# Altium project Copy of PUL_V5_RA.PrjPcb
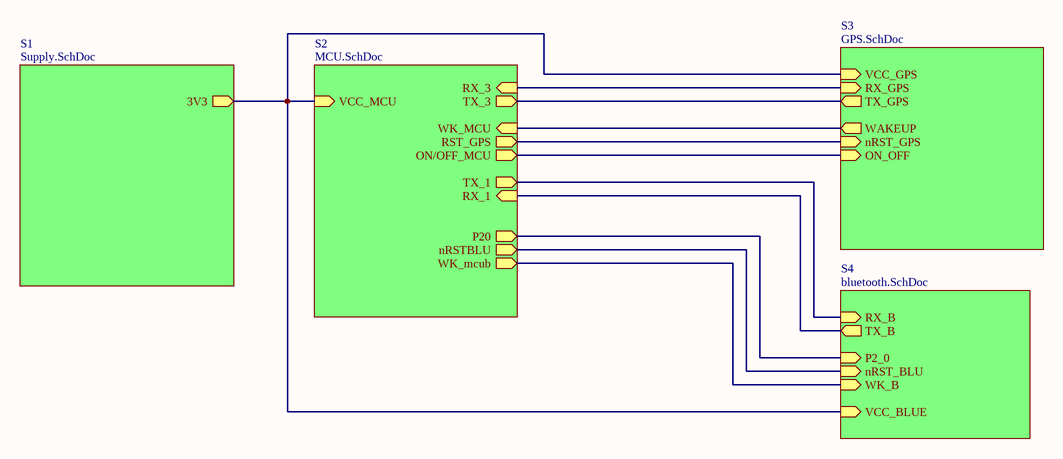
[diagram p0: PUL_V5_RA.SchDoc]
5 sheets, 56 parts. Net scope: hierarchical (ports join the sheet entries above them; power ports are global).
Board file: PUL_V5_RA.PcbDoc
Sheets:
  PUL_V5_RA.SchDoc
    S1 = Supply.SchDoc
    S2 = MCU.SchDoc
    S3 = GPS.SchDoc
    S4 = bluetooth.SchDoc

## Sheet PUL_V5_RA.SchDoc
size Letter

### Sub-sheets
S1 = Supply.SchDoc: 3V3 (out)
S2 = MCU.SchDoc: VCC_MCU (in), RX_3 (in), TX_3 (out), WK_MCU (in), RST_GPS (out), ON/OFF_MCU (out), RX_1 (in), TX_1 (out), P20 (out), nRSTBLU (out), WK_mcub (out)
S3 = GPS.SchDoc: VCC_GPS (in), ON_OFF (in), nRST_GPS (in), WAKEUP (out), RX_GPS (in), TX_GPS (out)
S4 = bluetooth.SchDoc: VCC_BLUE (in), RX_B (in), TX_B (out), P2_0 (in), nRST_BLU (in), WK_B (in)

### Nets
3v3: sheet S1/3V3, sheet S2/VCC_MCU, sheet S3/VCC_GPS, sheet S4/VCC_BLUE
RX: sheet S2/TX_1, sheet S4/RX_B
TX: sheet S2/RX_1, sheet S4/TX_B
NetC30_1: sheet S2/RST_GPS, sheet S3/nRST_GPS
NetC50_1: sheet S2/nRSTBLU, sheet S4/nRST_BLU
NetR26_2: sheet S2/RX_3, sheet S3/RX_GPS
NetR27_2: sheet S2/TX_3, sheet S3/TX_GPS
NetU20_4: sheet S2/WK_mcub, sheet S4/WK_B
NetU20_5: sheet S2/P20, sheet S4/P2_0
NetU20_6: sheet S2/ON/OFF_MCU, sheet S3/ON_OFF
NetU20_7: sheet S2/WK_MCU, sheet S3/WAKEUP

### Notes on the sheet
- Proyecto:
- CENTRO DE INGENIERIA Y DESARROLLO INDUSTRIAL
- Titulo:
- Fecha:
- Hoja:
- Elaborado por:
- de
- Hora:
- Revisión:
- Revisado por:
- CIDESI_template_letter

## Sheet Supply.SchDoc
size Letter
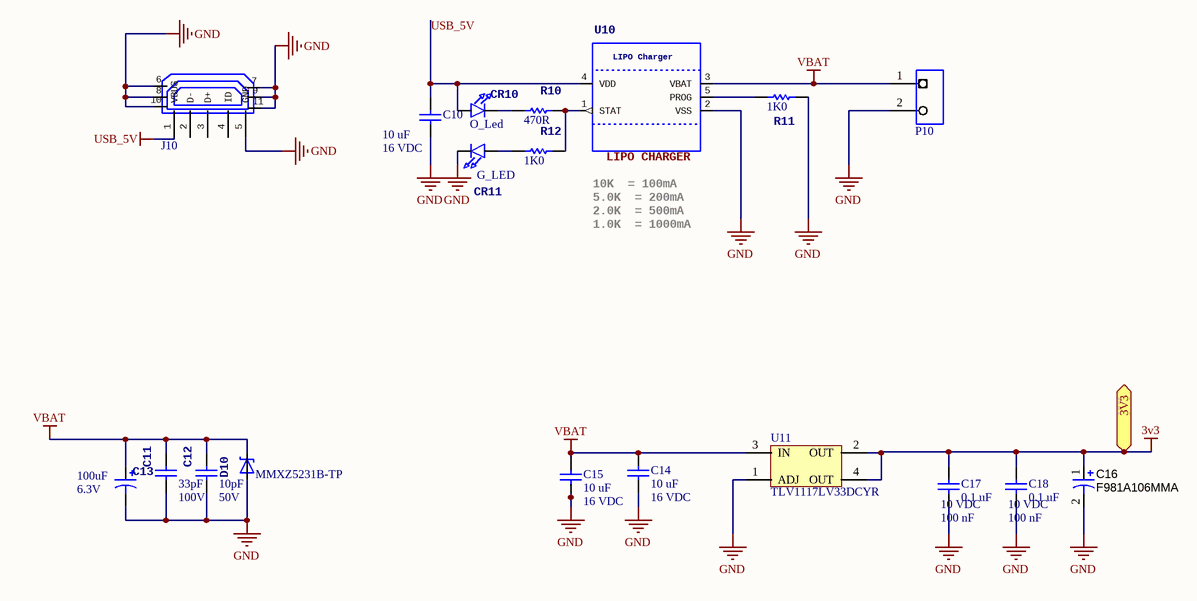
[diagram p1: Supply.SchDoc]

### Parts
C10  Capacitance: 10 uF  Voltage Rating DC: 16 VDC  [C0603]  (hidden comment: EMK107BBJ106MA-T)
C11  Capacitance: 33pF  Voltage Rating: 100V  [0805-C]  (hidden comment: 08051A330JAT2A)
C12  Capacitance: 10pF  Voltage Rating: 50V  [0805-C]  (hidden comment: 04025A100JAT2A)
C13  Capacitance: 100uF  Voltage Rating: 6.3V  [C1210]  (hidden comment: C3225X6S0J107M250AC)
C14  Capacitance: 10 uF  Voltage Rating DC: 16 VDC  [C0603]  (hidden comment: EMK107BBJ106MA-T)
C15  Capacitance: 10 uF  Voltage Rating DC: 16 VDC  [C0603]  (hidden comment: EMK107BBJ106MA-T)
C16  F981A106MMA  [C0603_P]
C17  Capacitance: 0.1 uF  Voltage Rating DC: 10 VDC  Capacitance - nF: 100 nF  [C0402]  (hidden comment: 100 nF, 10 V)
C18  Capacitance: 0.1 uF  Voltage Rating DC: 10 VDC  Capacitance - nF: 100 nF  [C0402]  (hidden comment: 100 nF, 10 V)
CR10  Product: O_Led  [0402-LED_RED]  (hidden comment: Led_Orange_0402)
CR11  Product: G_LED  [0402-LED_GRE]  (hidden comment: SML-P11MTT86R)
D10  Manufacturer Part Number: MMXZ5231B-TP  [SOD-123]  (hidden comment: MMSZ5231BT1G)
J10  1981568-1  [TYCO_19815681N]  (value not drawn)
P10  header  [HDR1X2]  (value not drawn)
R10  Resistance: 470R  [0805-R]  (hidden comment: CRCW0805470RJNEA)
R11  Resistance: 1K0  [0805-R]  (hidden comment: CRCW08051K00JNEB)
R12  Resistance: 1K0  [0805-R]  (hidden comment: CRCW08051K00JNEB)
U10  MCP73831T-2ACI/OT  [SOT23-5]  (value not drawn)
U11  TLV1117LV33DCYR  [SOT230P700X180-4AN]

### Ports
3V3 (out)

### Nets
3v3: C16.1(+) C17.1 C18.1 U11.2(OUT) U11.4(OUT) ; port 3V3
GND: C10.2 C11.2 C12.2 C13.2(-) C14.2 C15.2 C16.2(-) C17.2 C18.2 CR11.K D10.A J10.5(GND) J10.6 J10.7 J10.8 J10.9 J10.10 J10.11 P10.2 R11.2 U10.2(VSS) U11.1(ADJ)
USB_5V: C10.1 CR10.A J10.1(VBUS) U10.4(VDD)
VBAT: C11.1 C12.1 C13.1(+) C14.1 C15.1 D10.C P10.1 U10.3(VBAT) U11.3(IN)
NetCR10_K: CR10.K R10.1
NetCR11_A: CR11.A R12.1
NetR10_2: R10.2 R12.2 U10.1(STAT)
NetR11_1: R11.1 U10.5(PROG)

Not connected (* = marked no-connect by the designer): J10 2(D-) 3(D+) 4(ID)

### Notes on the sheet
- LIPO CHARGER
- 10K  = 100mA
- 5.0K  = 200mA
- 2.0K  = 500mA
- 1.0K  = 1000mA
- Proyecto:
- CENTRO DE INGENIERIA Y DESARROLLO INDUSTRIAL
- Titulo:
- Fecha:
- Hoja:
- Elaborado por:
- de
- Hora:
- Revisión:
- Revisado por:
- CIDESI_template_letter

### Library data of the parts
C10 C14 C15 = 10 uF, 16 V: Cap_Cer; Manufacturer: Taiyo Yuden; Tolerance: 20 %; Type: General Purpose; Class: Class 2; Dielectric: X5R; Supplier 1: Mouser; Manufacturer Part Number: EMK107BBJ106MA-T; RoHS: RoHS Compliant; Category: Multilayer Ceramic Capacitors MLCC - SMD/SMT; Stock 1: 78303; Pricing 1: 1=0.530, 10=0.278, 100=0.163, 500=0.126, 1000=0.100, 4000=0.100 (USD); Diameter: -; Height: 0.8 mm; Length: 1.6 mm; Package / Case: 0603 (1608 metric); Packaging: Reel; Product: General Type MLCCs; Series: M; Termination Style: SMD/SMT; Width: 0.8 mm; Brand: Taiyo Yuden; Case Code - in: 0603; Case Code - mm: 1608; Maximum Operating Temperature: + 85 C; Minimum Operating Temperature: - 55 C; Standard Pack Qty: 4000; Termination: -; RoHS - Mouser: Y; Minimum Order Quantity: 1; Reeling: True; ComponentLink1URL: http://www.mouser.com/ds/2/396/mlcc11_hq_e-541564.pdf; ComponentLink1Description: http://www.mouser.com/ds/2/396/mlcc11_hq_e-541564.pdf; Supplier Part Number 1: 963-EMK107BBJ106MA-T
C11 = 33pF, 100V: Cap_Cer; Manufacturer: AVX; Ceramic Capacitor Case: 0805 [2012 Metric]; Capacitance Tolerance: 5%; Dielectric Characteristic: C0G / NP0; Supplier 1: Newark; Manufacturer Part Number: 08051A330JAT2A; RoHS: YES; Stock 1: 2874; Pricing 1: 1=0.012, 25=0.012, 50=0.012, 100=0.012, 250=0.012, 500=0.012, 1000=0.012, 2500=0.012 (USD); Product Range: -; Packaging: Cut Tape; ComponentLink1URL: http://www.avx.com/docs/Catalogs/cpack.pdf; ComponentLink1Description: http://www.avx.com/docs/Catalogs/cpack.pdf; ComponentLink2URL: http://www.farnell.com/cad/1614359.zip; ComponentLink2Description: http://www.farnell.com/cad/1614359.zip; ComponentLink3URL: http://www.farnell.com/datasheets/2068140.pdf; ComponentLink3Description: http://www.farnell.com/datasheets/2068140.pdf; Supplier Part Number 1: 96K4771
C12 = 10pF, 50V: Cap_Cer; Manufacturer: AVX; Ceramic Capacitor Case: 0402 [1005 Metric]; Capacitance Tolerance: 5%; Dielectric Characteristic: C0G / NP0; Supplier 1: Newark; Manufacturer Part Number: 04025A100JAT2A; RoHS: YES; Stock 1: 235697; Pricing 1: 1=0.003, 25=0.003, 100=0.003, 250=0.003, 500=0.003, 1000=0.003, 2500=0.003 (USD); Product Range: -; Packaging: Cut Tape; ComponentLink1URL: http://www.farnell.com/datasheets/2068140.pdf; ComponentLink1Description: http://www.farnell.com/datasheets/2068140.pdf; Supplier Part Number 1: 96M1128
C13 = 100uF, 6.3V: Cap_Pol; Manufacturer: TDK; Ceramic Capacitor Case: 1210 [3225 Metric]; Capacitance Tolerance: 20%; Dielectric Characteristic: X6; Product Range: C Series; Supplier 1: Newark; Manufacturer Part Number: C3225X6S0J107M250AC; RoHS: YES; Stock 1: 1165; Pricing 1: 1=2.09, 10=1.72, 25=1.48, 50=1.24, 100=1.01, 250=0.95, 500=0.897 (USD); Packaging: Cut Tape; ComponentLink1URL: http://bcove.me/dwwzmldz; ComponentLink1Description: http://bcove.me/dwwzmldz; ComponentLink2URL: http://www.farnell.com/datasheets/2291921.pdf; ComponentLink2Description: http://www.farnell.com/datasheets/2291921.pdf; Supplier Part Number 1: 78Y7998
C16 = 10UF, 10V, C_TAN: CAP_TAN; Manufacturer 1: NICHICON; Value: 10 uF; Product Range: NICHICON - F98 Series; Capacitance: 10; Capacitance Tolerance: ± 20%; Capacitor Case Style: 0603 ^1608 Metric]; ESR: 7.5; Description 1: NICHICON - F981A106MMA - CAPACITOR TANT, 10UF, 10V 20%; Supplier 1: Farnell; Stock 1: 9201; Pricing 1: 1=0.282, 10=0.236, 100=0.169, 250=0.148, 500=0.131, 1000=0.117 (GBP); Voltage Rating: 10; Operating Temperature Max: 125; Series: F98; ComponentLink1URL: http://www.nichicon.co.jp/english/products/pdfs/e-f98.pdf; ComponentLink1Description: http://www.nichicon.co.jp/english/products/pdfs/e-f98.pdf; Supplier Part Number 1: 1853431; Manufacturer Part Number 1: F981A106MMA; RoHS 1: YES; Manufacturer Part Number: F981A106MMA
C17 C18 = 100 nF, 10 V: Cap_Cer; Manufacturer: Murata Electronics; Manufacturer Part Number: GRM155R71A104KA01D; Tolerance: 10 %; Type: General Purpose MLCC; Capacitance - pF: 100000 pF; Dielectric: X7R; Qualification: Commercial; Supplier 1: Mouser; RoHS: RoHS Compliant; Stock 1: 259611; Pricing 1: 1=0.100, 10=0.006, 100=0.004, 500=0.003, 10000=0.003 (USD); Packaging: Reel; ComponentLink1URL: http://www.mouser.com/ds/2/281/c02e-2905.pdf; ComponentLink1Description: http://www.mouser.com/ds/2/281/c02e-2905.pdf; Supplier Part Number 1: 81-GRM155R71A104KA1D; Category: Multilayer Ceramic Capacitors MLCC - SMD/SMT; Height: 0.5 mm; Length: 1 mm; Package / Case: 0402 (1005 metric); Product: General Type MLCCs; Series: GRM; Termination Style: SMD/SMT; Width: 0.5 mm; Brand: Murata Electronics; Case Code - in: 0402; Case Code - mm: 1005; Maximum Operating Temperature: + 125 C; Minimum Operating Temperature: - 55 C; Standard Pack Qty: 10000; RoHS - Mouser: Y; Minimum Order Quantity: 1; Reeling: True
CR10 = Led_Orange_0402: Led_Orange; Manufacturer: ROHM Semiconductor; Manufacturer Part Number: SML-P12DTT86R; Illumination Color: Orange; Luminous Intensity: 100 mcd; If - Forward Current: 20 mA; Lens Transparency: Water Clear; Vf - Forward Voltage: 2.1 V; Wavelength/Color Temperature: 605 nm; Supplier 1: Mouser; RoHS: RoHS Compliant; Category: Standard LEDs - SMD; Stock 1: 22469; Pricing 1: 1=0.546, 10=0.347, 100=0.150, 1000=0.114, 5000=0.087 (MXN); Length: 1 mm; Orientation: Top View; Package / Case: 0402 (1005 metric); Packaging: Cut Tape; Series: SML-P1x; Width: 0.6 mm; Brand: ROHM Semiconductor; Mounting Style: SMD/SMT; Viewing Angle: -; Maximum Operating Temperature: + 85 C; Minimum Operating Temperature: - 40 C; Moisture Sensitive: Yes; Product Type: LED - Standard; Standard Pack Qty: 5000; Subcategory: LEDs; Tradename: PICOLED; RoHS - Mouser: Y; Minimum Order Quantity: 1; Reeling: True; ComponentLink1URL: https://www.mouser.com/datasheet/2/348/sml-p1-e-1809025.pdf; ComponentLink1Description: https://www.mouser.com/datasheet/2/348/sml-p1-e-1809025.pdf; Supplier Part Number 1: 755-SML-P12DTT86R
CR11 = Led_Green_0402: Led_Green; Manufacturer: ROHM Semiconductor; Illumination Color: Green; Luminous Intensity: 2.1 mcd; If - Forward Current: 1 mA; Lens Transparency: Water Clear; Vf - Forward Voltage: 1.9 V; Wavelength/Color Temperature: 569 nm; Supplier 1: Mouser; Manufacturer Part Number: SML-P11MTT86R; RoHS: RoHS Compliant; Category: Standard LEDs - SMD; Stock 1: 15242; Pricing 1: 1=0.585, 10=0.376, 100=0.161, 1000=0.124, 5000=0.094 (MXN); Length: 1 mm; Orientation: Top View; Package / Case: 0402 (1006 metric); Packaging: Cut Tape; Series: SML-P11; Width: 0.6 mm; Brand: ROHM Semiconductor; Mounting Style: SMD/SMT; Viewing Angle: -; Maximum Operating Temperature: + 85 C; Minimum Operating Temperature: - 40 C; Moisture Sensitive: Yes; Product Type: LED - Standard; Standard Pack Qty: 5000; Subcategory: LEDs; Tradename: PICOLED; RoHS - Mouser: Y; Minimum Order Quantity: 1; Reeling: True; ComponentLink1URL: https://www.mouser.com/datasheet/2/348/sml-p11-e-1139217.pdf; ComponentLink1Description: https://www.mouser.com/datasheet/2/348/sml-p11-e-1139217.pdf; Supplier Part Number 1: 755-SML-P11MTT86R
D10 = Diode_Zener: Manufacturer: MICRO COMMERCIAL COMPONENTS; Zener Voltage Vz Typ: 5.1; Power Dissipation Pd: 200; Diode Case Style: SOD-323; Zener Tolerance: 5%; No. of Pins: 2; Supplier 1: Newark; RoHS: YES; Stock 1: 410; Pricing 1: 1=0.602, 10=0.434, 100=0.256, 250=0.181, 500=0.139, 1000=0.098, 5000=0.082, 10000=0.07 (USD); Operating Temperature Max: 150 C; Product Range: -; Packaging: Cut Tape; ComponentLink1URL: http://61.222.192.61/mccsemi/up_pdf/Product%20Packaging.pdf; ComponentLink1Description: http://61.222.192.61/mccsemi/up_pdf/Product%20Packaging.pdf; ComponentLink2URL: http://www.farnell.com/datasheets/1699886.pdf; ComponentLink2Description: http://www.farnell.com/datasheets/1699886.pdf; Supplier Part Number 1: 51T4940
J10 = USB: Micro USB; Manufacturer: AMP - TE CONNECTIVITY; Supplier 1: Newark; Manufacturer Part Number: 1981568-1; Stock 1: 1013; Pricing 1: 1=1.39, 10=1.39, 25=1.39, 50=1.29, 100=1.29, 250=1.29, 500=1.29 (USD); ComponentLink1URL: http://www.farnell.com/datasheets/1650952.pdf; ComponentLink1Description: http://www.farnell.com/datasheets/1650952.pdf; ComponentLink2URL: http://www.farnell.com/datasheets/1654342.pdf; ComponentLink2Description: http://www.farnell.com/datasheets/1654342.pdf; ComponentLink3URL: http://www.farnell.com/cad/1957472.pdf; ComponentLink3Description: http://www.farnell.com/cad/1957472.pdf; ComponentLink4URL: https://players.brightcove.net/1362235890001/BJ9h2Pe9_default/index.html?videoId=5970358614001; ComponentLink4Description: https://players.brightcove.net/1362235890001/BJ9h2Pe9_default/index.html?videoId=5970358614001; ComponentLink5URL: https://players.brightcove.net/1362235890001/BJ9h2Pe9_default/index.html?videoId=5970358640001; ComponentLink5Description: https://players.brightcove.net/1362235890001/BJ9h2Pe9_default/index.html?videoId=5970358640001; ComponentLink6URL: https://players.brightcove.net/1362235890001/BJ9h2Pe9_default/index.html?videoId=5970356014001; ComponentLink6Description: https://players.brightcove.net/1362235890001/BJ9h2Pe9_default/index.html?videoId=5970356014001; Supplier Part Number 1: 73M8666
P10 = header: Bateria; Manufacturer Part Number: No aplica
R10 = 470R0, 125mW: Resistor; Manufacturer: VISHAY; Supplier 1: Newark; Manufacturer Part Number: CRCW0805470RJNEA; RoHS: YES; Stock 1: 1520; Pricing 1: 1=0.131, 25=0.055, 50=0.043, 100=0.032, 250=0.032, 500=0.03, 1000=0.023 (USD); ComponentLink1URL: http://www.vishay.com/docs/20014/smdpack.pdf; ComponentLink1Description: http://www.vishay.com/docs/20014/smdpack.pdf; ComponentLink2URL: http://www.farnell.com/cad/1552941.zip; ComponentLink2Description: http://www.farnell.com/cad/1552941.zip; ComponentLink3URL: http://www.farnell.com/datasheets/2111203.pdf?_ga=1.39057253.733356815.1493180800; ComponentLink3Description: http://www.farnell.com/datasheets/2111203.pdf?_ga=1.39057253.733356815.1493180800; Supplier Part Number 1: 59M8584
R11 R12 = 1K0, 125mW: Resistor; Manufacturer: VISHAY; Voltage Rating: 150V; Resistor Case Style: 0805 [2012 Metric]; Power Rating: 125; Resistance Tolerance: 5%; Product Range: CRCW Series; Supplier 1: Newark; Manufacturer Part Number: CRCW08051K00JNEB; RoHS: YES; Stock 1: 2322; Pricing 1: 1=0.004, 25=0.004, 100=0.004 (USD); Packaging: Cut Tape; MSL: MSL 1 - Unlimited; ComponentLink1URL: http://www.vishay.com/docs/20014/smdpack.pdf; ComponentLink1Description: http://www.vishay.com/docs/20014/smdpack.pdf; ComponentLink2URL: http://www.farnell.com/cad/1552627.zip; ComponentLink2Description: http://www.farnell.com/cad/1552627.zip; ComponentLink3URL: http://www.farnell.com/datasheets/2111203.pdf?_ga=1.39057253.733356815.1493180800; ComponentLink3Description: http://www.farnell.com/datasheets/2111203.pdf?_ga=1.39057253.733356815.1493180800; Supplier Part Number 1: 65J1337
U10 = MCP73831/2: Charger; Manufacturer: MICROCHIP; Battery Type: Li-Ion, Li-Pol; Input Voltage: 6; Battery Charge Voltage: 4.2; Charge Current Max: 500; Battery IC Case Style: SOT-23; No. of Pins: 5; No. of Series Cells: 1; Supplier 1: Newark; Manufacturer Part Number: MCP73831T-2ACI/OT; RoHS: YES; Stock 1: 3000; Pricing 1: 3000=0.619 (USD); Packaging: Tape & Reel; ComponentLink1URL: http://www.farnell.com/cad/1545964.zip; ComponentLink1Description: http://www.farnell.com/cad/1545964.zip; ComponentLink2URL: http://www.farnell.com/datasheets/2124927.pdf; ComponentLink2Description: http://www.farnell.com/datasheets/2124927.pdf; ComponentLink3URL: http://www.farnell.com/datasheets/2338016.pdf; ComponentLink3Description: http://www.farnell.com/datasheets/2338016.pdf; MCP73831/2: MCP73831/2; Temp:: Temp:; -40-85°C: -40-85°C; VDD:: VDD:; 3.75-6V: 3.75-6V; Supplier Part Number 1: 28X3685; LIPO Charger: LIPO Charger
U11 = IC,LDO,3V3,1A,TLV1117LV: Regulador3V3; Manufacturer: TEXAS INSTRUMENTS; Output Type: Fixed; Input Voltage Min: 2; Input Voltage Max: 5.5; Fixed Output Voltage Nom.: 3.3; Output Current: 1; Supplier 1: Newark; RoHS: YES; Stock 1: 547; Pricing 1: 1=0,618, 10=0,515, 100=0,332, 1000=0,266 (USD); Adjustable Output Voltage Min: -; Adjustable Output Voltage Max: -; ComponentLink1URL: http://www.farnell.com/simulation/1746677.zip; ComponentLink1Description: http://www.farnell.com/simulation/1746677.zip; ComponentLink2URL: http://www.ti.com/general/docs/lit/getliterature.tsp?genericPartNumber=TLV1117LV&amp;&amp;fileType=pdf; ComponentLink2Description: http://www.ti.com/general/docs/lit/getliterature.tsp?genericPartNumber=TLV1117LV&amp;&amp;fileType=pdf; Supplier Part Number 1: 48T4644; Manufacturer Part Number: TLV1117LV33DCYR

## Sheet MCU.SchDoc
size Letter
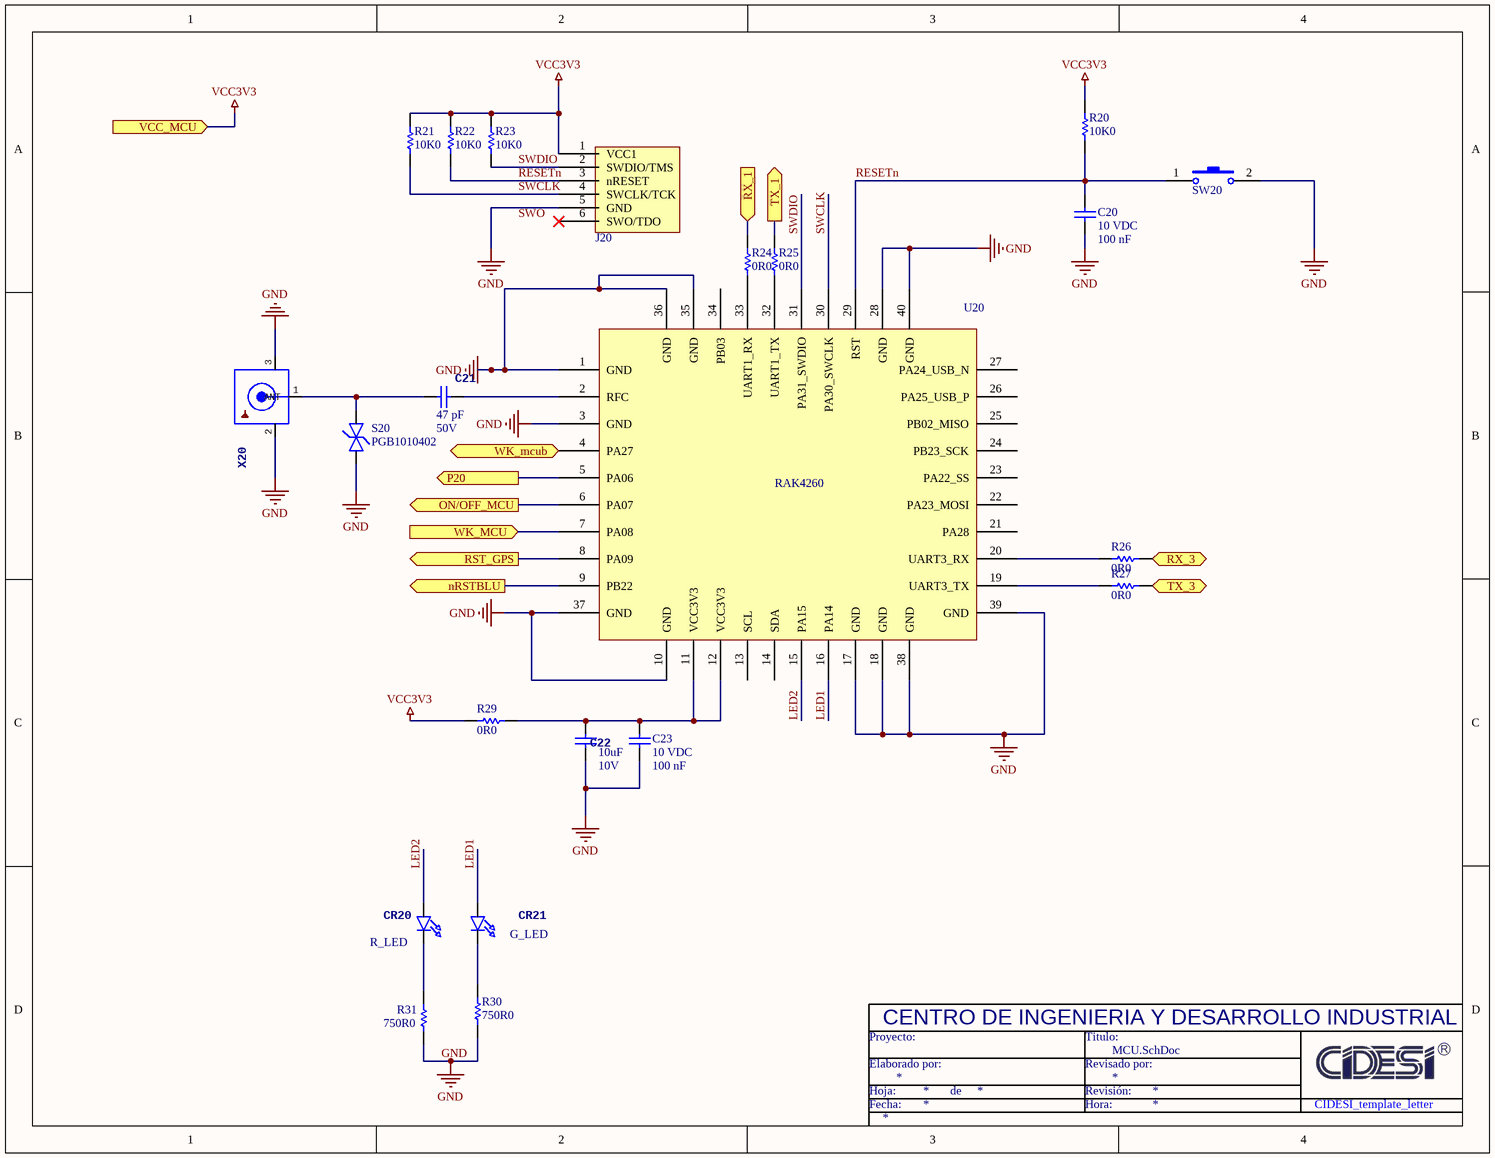
[diagram p2: MCU.SchDoc]

### Parts
C20  Voltage Rating DC: 10 VDC  Capacitance - nF: 100 nF  [C0402]  (hidden comment: 100 nF, 10 V)
C21  Capacitance: 47 pF  Voltage Rating DC: 50V  [C0402]  (hidden comment: GCQ1555C1H470JB01D)
C22  Capacitance: 10uF  Voltage Rating DC: 10V  [C0402]  (hidden comment: ZRB15XR61A106ME01D)
C23  Voltage Rating DC: 10 VDC  Capacitance - nF: 100 nF  [C0402]  (hidden comment: 100 nF, 10 V)
CR20  Product: R_LED  [0603_LED]  (hidden comment: KO DELLS1.22-KHLI-24)
CR21  Product: G_LED  [0603_LED]  (hidden comment: KG DELMS1.22-PHQI-24-E6L6)
J20  ICSP  [TC2030-MCP-NL]  (value not drawn)
R20  value 10K0  [0402_RES]  (hidden comment: CRCW040210K0FKTD)
R21  value 10K0  [0402_RES]  (hidden comment: CRCW040210K0FKTD)
R22  value 10K0  [0402_RES]  (hidden comment: CRCW040210K0FKTD)
R23  value 10K0  [0402_RES]  (hidden comment: CRCW040210K0FKTD)
R24  PANASONIC ELECTRONIC COMPONENTS  [0402_RES]  (value not drawn)
R25  PANASONIC ELECTRONIC COMPONENTS  [0402_RES]  (value not drawn)
R26  PANASONIC ELECTRONIC COMPONENTS  [0402_RES]  (value not drawn)
R27  PANASONIC ELECTRONIC COMPONENTS  [0402_RES]  (value not drawn)
R29  PANASONIC ELECTRONIC COMPONENTS  [0402_RES]  (value not drawn)
R30  Resistance: 750R0  [0402_RES]  (hidden comment: ERJ-2GEJ751X)
R31  Resistance: 750R0  [0402_RES]  (hidden comment: ERJ-2GEJ751X)
S20  PGB1010402  [Supresor_0402]
SW20  95C04A3GWRT  [Push Button SMDsin]  (value not drawn)
U20  RAK4260  [RAK4260]
X20  RECE.20279.001E.01  [U.FL]  (value not drawn)

### Ports
nRSTBLU (out), ON/OFF_MCU (out), P20 (out), RST_GPS (out), RX_1 (in), RX_3 (in), TX_1 (out), TX_3 (out), VCC_MCU (in), WK_MCU (in), WK_mcub (in)

### Nets
GND: C20.2 C22.2 C23.2 J20.5(GND) R30.1 R31.2 S20.2 SW20.2 U20.1(GND) U20.3(GND) U20.10(GND) U20.17(GND) U20.18(GND) U20.28(GND) U20.35(GND) U20.36(GND) U20.37(GND) U20.38(GND) U20.39(GND) U20.40(GND) X20.2(GND) X20.3(GND)
VCC3V3: J20.1(VCC1) R20.2 R21.2 R22.2 R23.2 R29.1 ; port VCC_MCU  [project net 3v3]
LED1: CR21.A U20.16(PA14)
LED2: CR20.A U20.15(PA15)
RESETn: C20.1 J20.3(nRESET) R20.1 R22.1 SW20.1 U20.29(RST)
RX: R25.2 ; port TX_1
SWCLK: J20.4(SWCLK/TCK) R21.1 U20.30(PA30_SWCLK)
SWDIO: J20.2(SWDIO/TMS) R23.1 U20.31(PA31_SWDIO)
TX: R24.2 ; port RX_1
NetC21_1: C21.1 S20.1 X20.1(ANT)
NetC21_2: C21.2 U20.2(RFC)
NetC22_1: C22.1 C23.1 R29.2 U20.11(VCC3V3) U20.12(VCC3V3)
NetC30_1: U20.8(PA09) ; port RST_GPS
NetC50_1: U20.9(PB22) ; port nRSTBLU
NetCR20_K: CR20.K R31.1
NetCR21_K: CR21.K R30.2
NetR24_1: R24.1 U20.33(UART1_RX)
NetR25_1: R25.1 U20.32(UART1_TX)
NetR26_1: R26.1 U20.20(UART3_RX)
NetR26_2: R26.2 ; port RX_3
NetR27_1: R27.1 U20.19(UART3_TX)
NetR27_2: R27.2 ; port TX_3
NetU20_4: U20.4(PA27) ; port WK_mcub
NetU20_5: U20.5(PA06) ; port P20
NetU20_6: U20.6(PA07) ; port ON/OFF_MCU
NetU20_7: U20.7(PA08) ; port WK_MCU

Not connected (* = marked no-connect by the designer): J20 6(SWO/TDO)*; U20 13(SCL) 14(SDA) 21(PA28) 22(PA23_MOSI) 23(PA22_SS) 24(PB23_SCK) 25(PB02_MISO) 26(PA25_USB_P) 27(PA24_USB_N) 34(PB03)

### Notes on the sheet
- Labels drawn without touching a wire or pin: SWO
- Proyecto:
- CENTRO DE INGENIERIA Y DESARROLLO INDUSTRIAL
- Titulo:
- Fecha:
- Hoja:
- Elaborado por:
- de
- Hora:
- Revisión:
- Revisado por:
- CIDESI_template_letter

### Library data of the parts
C20 C23 = 100 nF, 10 V: Multilayer Ceramic Capacitors MLCC - SMD/SMT 0402 0.1uF 10volts X7R 10%; Manufacturer: Murata Electronics; Manufacturer Part Number: GRM155R71A104KA01D; Type: General Purpose MLCC; Capacitance - pF: 100000 pF; Qualification: Commercial; Supplier 1: Mouser; RoHS: RoHS Compliant; Category: Multilayer Ceramic Capacitors MLCC - SMD/SMT; Stock 1: 259611; Pricing 1: 1=0.100, 10=0.006, 100=0.004, 500=0.003, 10000=0.003 (USD); Capacitance: 0.1 uF; Height: 0.5 mm; Length: 1 mm; Package / Case: 0402 (1005 metric); Packaging: Reel; Product: General Type MLCCs; Series: GRM; Termination Style: SMD/SMT; Tolerance: 10 %; Width: 0.5 mm; Brand: Murata Electronics; Case Code - in: 0402; Case Code - mm: 1005; Dielectric: X7R; Maximum Operating Temperature: + 125 C; Minimum Operating Temperature: - 55 C; Standard Pack Qty: 10000; RoHS - Mouser: Y; Minimum Order Quantity: 1; Reeling: True; ComponentLink1URL: http://www.mouser.com/ds/2/281/c02e-2905.pdf; ComponentLink1Description: http://www.mouser.com/ds/2/281/c02e-2905.pdf; Supplier Part Number 1: 81-GRM155R71A104KA1D
C21 = 47pF, 50V: Cap_Cer; Manufacturer: Murata Electronics; Tolerance: 5 %; Type: High Q Chip Multilayer Ceramic Capacitors for Automotive; Dielectric: C0G (NP0); Qualification: AEC-Q200; Supplier 1: Mouser; Manufacturer Part Number: GCQ1555C1H470JB01D; RoHS: RoHS Compliant; Category: Multilayer Ceramic Capacitors MLCC - SMD/SMT; Stock 1: 18694; Pricing 1: 1=0.455, 10=0.319, 100=0.191, 500=0.143, 1000=0.121, 2500=0.100, 5000=0.095, 10000=0.086, 20000=0.083 (MXN); Height: 0.5 mm; Length: 1 mm; Package / Case: 0402 (1005 metric); Packaging: Cut Tape; Product: Automotive MLCCs; Series: GCQ; Termination Style: SMD/SMT; Width: 0.5 mm; Brand: Murata Electronics; Case Code - in: 0402; Case Code - mm: 1005; Maximum Operating Temperature: + 125 C; Minimum Operating Temperature: - 55 C; Product Type: Ceramic Capacitors; Standard Pack Qty: 10000; Subcategory: Capacitors; Termination: Standard; RoHS - Mouser: Y; Minimum Order Quantity: 1; Reeling: True; ComponentLink1URL: https://www.mouser.com/datasheet/2/281/GCQ1555C1HR51WB01-01-1154307.pdf; ComponentLink1Description: https://www.mouser.com/datasheet/2/281/GCQ1555C1HR51WB01-01-1154307.pdf; Supplier Part Number 1: 81-GCQ1555C1H470JB1D
C22 = 10uF, 10V: Cap_Cer; Manufacturer: Murata Electronics; Tolerance: 20 %; Type: General Purpose Multilayer Ceramic Chip Capacitor; Class: Class 2; Dielectric: X5R; Supplier 1: Mouser; Manufacturer Part Number: ZRB15XR61A106ME01D; RoHS: RoHS Compliant; Category: Multilayer Ceramic Capacitors MLCC - SMD/SMT; Stock 1: 361820; Pricing 1: 1=0.624, 10=0.436, 100=0.261, 500=0.196, 1000=0.165, 2500=0.137, 5000=0.129, 8000=0.117, 24000=0.113 (MXN); Height: 0.65 mm; Length: 1 mm; Package / Case: 0402 (1005 metric); Packaging: Cut Tape; Product: General Type MLCCs; Series: ZRB; Termination Style: SMD/SMT; Width: 0.5 mm; Brand: Murata Electronics; Case Code - in: 0402; Case Code - mm: 1005; Maximum Operating Temperature: + 85 C; Minimum Operating Temperature: - 55 C; Product Type: Ceramic Capacitors; Standard Pack Qty: 8000; Subcategory: Capacitors; Termination: Interposer Substrate; RoHS - Mouser: Y; Minimum Order Quantity: 1; Reeling: True; ComponentLink1URL: https://www.mouser.com/datasheet/2/281/ZRB15XR61A106ME01-01-1771691.pdf; ComponentLink1Description: https://www.mouser.com/datasheet/2/281/ZRB15XR61A106ME01-01-1771691.pdf; Supplier Part Number 1: 81-ZRB15XR61A106ME1D
CR20 = Led_Red_0603: Led_Red; Manufacturer: OSRAM Opto Semiconductors; Manufacturer Part Number: KR DELPS1.22-UHVI-26-H3Q4; Illumination Color: Red; Lens Color: Colorless; Luminous Intensity: 520 mcd; Viewing Angle: 120 deg; If - Forward Current: 20 mA; Lens Transparency: Clear; Vf - Forward Voltage: 2.2 V; Wavelength/Color Temperature: 617 nm; Product Status: New Product; Supplier 1: Mouser; RoHS: RoHS Compliant; Category: Standard LEDs - SMD; Stock 1: 22857; Pricing 1: 1=0.572, 10=0.346, 100=0.160, 1000=0.133, 5000=0.103, 10000=0.094, 25000=0.087, 50000=0.079, 100000=0.077 (MXN); Height: 0.6 mm; Length: 1.6 mm; Orientation: Top View; Package / Case: 0603 (1608 metric); Packaging: Cut Tape; Series: TOPLED E 1608; Width: 0.8 mm; Brand: OSRAM Opto Semiconductors; Mounting Style: SMD/SMT; Maximum Operating Temperature: + 110 C; Minimum Operating Temperature: - 40 C; Moisture Sensitive: Yes; Product Type: LED - Standard; Standard Pack Qty: 5000; Subcategory: LEDs; RoHS - Mouser: Y; Minimum Order Quantity: 1; Reeling: True; Supplier Part Number 1: 720-KRDELPS122A5163
CR21 = Led_Green_0603: Led_Green; Manufacturer: OSRAM Opto Semiconductors; Illumination Color: Green; Lens Color: Colorless; Luminous Intensity: 52 mcd; Viewing Angle: 120 deg; If - Forward Current: 20 mA; Lens Transparency: Clear; Vf - Forward Voltage: 2 V; Wavelength/Color Temperature: 570 nm; Product Status: New Product; Supplier Part Number 1: 32M3102; Supplier 2: Mouser; Manufacturer Part Number: KG DELMS1.22-PHQI-24-E6L6; RoHS: RoHS Compliant; Category: Standard LEDs - SMD; Stock 2: 7946; Pricing 2: 1=0.546, 10=0.317, 100=0.182, 1000=0.142, 5000=0.122, 10000=0.112, 25000=0.104, 50000=0.095, 100000=0.091 (MXN); Height: 0.6 mm; Length: 1.6 mm; Orientation: Top View; Package / Case: 0603 (1608 metric); Packaging: Cut Tape; Series: TOPLED E 1608; Width: 0.8 mm; Brand: OSRAM Opto Semiconductors; Mounting Style: SMD/SMT; Maximum Operating Temperature: + 110 C; Minimum Operating Temperature: - 40 C; Moisture Sensitive: Yes; Product Type: LED - Standard; Standard Pack Qty: 5000; Subcategory: LEDs; RoHS - Mouser: Y; Minimum Order Quantity: 1; Reeling: True; Supplier Part Number 2: 720-KGDELMS122A4854
J20 = ICSP: Footprint Programador; Manufacturer Part Number: No aplica
R20-R23 = 10 KOHM, 63 mW: Resistor; Manufacturer 1: VISHAY DALE; Supplier 1: Newark; Manufacturer Part Number: CRCW040210K0FKTD; RoHS: NO; Stock 1: 12163; Pricing 1: 1=0.073, 10=0.039, 100=0.023, 1000=0.019 (USD); ComponentLink1URL: http://www.farnell.com/datasheets/1914725.pdf; ComponentLink1Description: http://www.farnell.com/datasheets/1914725.pdf; Supplier Part Number 1: 96C9543
R24-R27 R29 = 0R0: Resistor; Manufacturer Part Number: ERJ-2GE0R00X; Product Range: ERJ2; Voltage Rating: 50; Resistor Case Style: 0402 [1005 Metric]; Power Rating: 100; Resistor Element Type: Thick Film; Supplier 1: Newark; Manufacturer: PANASONIC ELECTRONIC COMPONENTS; RoHS: YES; Stock 1: 130000; Pricing 1: 1=0.006, 10000=0.006 (USD); Resistance Tolerance: -; ComponentLink1URL: http://www.farnell.com/datasheets/2059623.pdf; ComponentLink1Description: http://www.farnell.com/datasheets/2059623.pdf; Supplier Part Number 1: 97W7189; Resistance: 0R0
R30 R31 = 750R0, 63mW: Resistor; Manufacturer: PANASONIC; Resistor Case Style: 0402 [1005 Metric]; Product Range: ERJ2; Voltage Rating: 50; Resistor Element Type: Thick Film; Power Rating: 100; Resistance Tolerance: ± 5%; Supplier 1: Newark; Manufacturer Part Number: ERJ-2GEJ751X; Stock 1: 36376; Pricing 1: 1=0.002, 25=0.002, 100=0.002, 250=0.002, 500=0.002, 1000=0.002 (USD); ComponentLink1URL: http://www.farnell.com/cad/1697902.zip; ComponentLink1Description: http://www.farnell.com/cad/1697902.zip; ComponentLink2URL: http://industrial.panasonic.com/cdbs/www-data/pdf/RDA0000/AOA0000C301.pdf; ComponentLink2Description: http://industrial.panasonic.com/cdbs/www-data/pdf/RDA0000/AOA0000C301.pdf; Supplier Part Number 1: 53W4178
S20 = PGB1010402: ESD Suppressor; Manufacturer: Littelfuse; Manufacturer Part Number: PGB1010402KR; Clamping Voltage: 250 V; Number of Channels: 1 Channel; Cd - Diode Capacitance: 0.04 pF; Operating Supply Voltage: 12 VDC; Polarity: Bidirectional; Vesd - Voltage ESD Air Gap: 15 kV; Vesd - Voltage ESD Contact: 8 kV; Working Voltage: 12 V; Supplier 1: Mouser; RoHS: RoHS Compliant; Category: ESD Suppressors / TVS Diodes; Stock 1: 46461; Pricing 1: 1=0.754, 10=0.614, 100=0.386, 1000=0.298, 2500=0.254, 10000=0.237, 20000=0.224, 50000=0.218 (MXN); Package / Case: 0402 (1005 metric); Packaging: Cut Tape; Series: PGB10402; Termination Style: SMD/SMT; Brand: Littelfuse; Maximum Operating Temperature: + 125 C; Minimum Operating Temperature: - 65 C; Product Type: ESD Suppressors; Standard Pack Qty: 10000; Subcategory: TVS Diodes / ESD Suppression Diodes; RoHS - Mouser: Y; Minimum Order Quantity: 1; Reeling: True; ComponentLink1URL: https://www.mouser.com/datasheet/2/240/Littelfuse_PulseGuard_PGB1_Datasheet.pdf-461684.pdf; ComponentLink1Description: https://www.mouser.com/datasheet/2/240/Littelfuse_PulseGuard_PGB1_Datasheet.pdf-461684.pdf; Supplier Part Number 1: 576-PGB1010402KR
SW20 = Push Buttom-SMD_large: Push Button SMD large; Manufacturer: Grayhill; Actuator: Rectangular; Contact Form: SPST; Current Rating: 50 mA; Operating Force: 160 g; Stem Height: 4.3 mm; Switch Function: OFF - (ON); Voltage Rating DC: 12 VDC; Ground Terminal: No; Illuminated: Non-Illuminated; Mounting Direction: Straight; Travel: 0.01 in; Supplier 1: Mouser; Manufacturer Part Number: 95C04A3GWRT; RoHS: RoHS Compliant; Category: Tactile Switches; Stock 1: 1446; Pricing 1: 1=0.650, 10=0.594, 100=0.450, 1000=0.332, 1800=0.315, 9000=0.298, 23400=0.291, 48600=0.281 (MXN); Color: Brown; Contact Plating: Silver; Height: 4.3 mm; Illumination Color: -; Length: 6 mm; Mounting Type: Snap-In; Packaging: Cut Tape; Power Rating: -; Product: Tactile Switches; Termination Style: Gull Wing Lead; Type: Momentary Pushbutton; Voltage Rating AC: -; Width: 3.5 mm; Brand: Grayhill; Lamp Type: -; Mounting Style: SMD/SMT; Maximum Operating Temperature: + 70 C; Minimum Operating Temperature: - 25 C; Product Type: Tactile Switches; Standard Pack Qty: 1800; Subcategory: Switches; RoHS - Mouser: Y; Minimum Order Quantity: 1; Reeling: True; ComponentLink1URL: https://www.mouser.com/datasheet/2/626/Tact_95C04-335311.pdf; ComponentLink1Description: https://www.mouser.com/datasheet/2/626/Tact_95C04-335311.pdf; Supplier Part Number 1: 706-95C04A3GWRT
U20 = RAK4260: MODULO LORA; Manufacturer 1: RAK; Manufacturer Part Number: RAK4260 LoRa® Module - US915; ComponentLink1URL: https://store.rakwireless.com/collections/lora-modules/products/rak4260-lora-module?variant=31767043735597
X20 = SMACONNECTOR_UFL: Connector UFL; Manufacturer: Taoglas; Supplier 1: Mouser; Manufacturer Part Number: RECE.20279.001E.01; RoHS: RoHS Compliant; Category: RF Connectors / Coaxial Connectors; Stock 1: 0; Brand: Taoglas; Product Type: RF Connectors / Coaxial Connectors; Subcategory: RF Interconnects; Minimum Order Quantity: 1; Reeling: False; Supplier Part Number 1: N/A

## Sheet GPS.SchDoc
size Letter
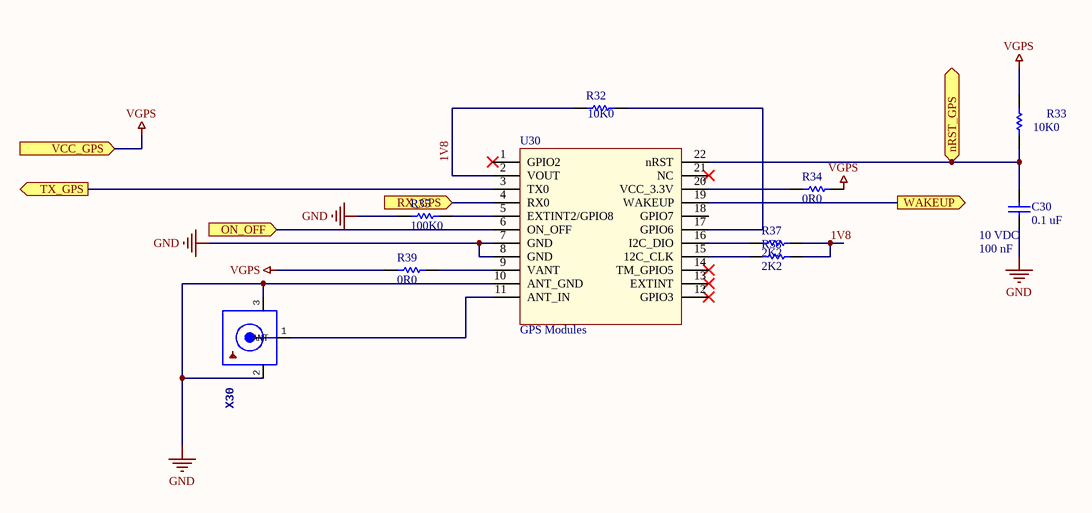
[diagram p3: GPS.SchDoc]

### Parts
C30  Capacitance: 0.1 uF  Voltage Rating DC: 10 VDC  Capacitance - nF: 100 nF  [C0402]  (hidden comment: 100 nF, 10 V)
R32  value 10K0  [0402_RES]  (hidden comment: CRCW040210K0FKTD)
R33  value 10K0  [0402_RES]  (hidden comment: CRCW040210K0FKTD)
R34  PANASONIC ELECTRONIC COMPONENTS  [0402_RES]  (value not drawn)
R35  Resistance: 100K0  [0402_RES]  (hidden comment: CRCW0402100KFKED)
R37  ERJ-2RKF2201X  [0402_RES]  (value not drawn)
R38  ERJ-2RKF2201X  [0402_RES]  (value not drawn)
R39  PANASONIC ELECTRONIC COMPONENTS  [0402_RES]  (value not drawn)
U30  Product Type: GPS Modules  [GPS]  (hidden comment: 927-A2200-A)
X30  RECE.20279.001E.01  [U.FL]  (value not drawn)

### Ports
nRST_GPS (in), ON_OFF (in), RX_GPS (in), TX_GPS (out), VCC_GPS (in), WAKEUP (out)

### Nets
GND: C30.2 R35.1 U30.7(GND) U30.8(GND) U30.10(ANT_GND) X30.2(GND) X30.3(GND)
VGPS: R33.2 R34.2 R39.1 ; port VCC_GPS  [project net 3v3]
1V8: R32.1 R37.2 R38.2 U30.2(VOUT)
NetC30_1: C30.1 R33.1 U30.22(nRST) ; port nRST_GPS
NetR26_2: U30.4(RX0) ; port RX_GPS
NetR27_2: U30.3(TX0) ; port TX_GPS
NetR32_2: R32.2 U30.17(GPIO6)
NetR34_1: R34.1 U30.20(VCC_3.3V)
NetR35_2: R35.2 U30.5(EXTINT2/GPIO8)
NetR37_1: R37.1 U30.16(I2C_DIO)
NetR38_1: R38.1 U30.15(12C_CLK)
NetR39_2: R39.2 U30.9(VANT)
NetU20_6: U30.6(ON_OFF) ; port ON_OFF
NetU20_7: U30.19(WAKEUP) ; port WAKEUP
NetU30_11: U30.11(ANT_IN) X30.1(ANT)

Not connected (* = marked no-connect by the designer): U30 1(GPIO2)* 12(GPIO3)* 13(EXTINT)* 14(TM_GPIO5)* 18(GPIO7) 21(NC)*

### Notes on the sheet
- Proyecto:
- CENTRO DE INGENIERIA Y DESARROLLO INDUSTRIAL
- Titulo:
- Fecha:
- Hoja:
- Elaborado por:
- de
- Hora:
- Revisión:
- Revisado por:
- CIDESI_template_letter

### Library data of the parts
C30 = 100 nF, 10 V: as C20 on sheet MCU; Supplier 1: Mouser; RoHS: RoHS Compliant; Stock 1: 259611; Pricing 1: 1=0.100, 10=0.006, 100=0.004, 500=0.003, 10000=0.003 (USD); Packaging: Reel; ComponentLink1URL: http://www.mouser.com/ds/2/281/c02e-2905.pdf; ComponentLink1Description: http://www.mouser.com/ds/2/281/c02e-2905.pdf; Supplier Part Number 1: 81-GRM155R71A104KA1D; Category: Multilayer Ceramic Capacitors MLCC - SMD/SMT; Height: 0.5 mm; Length: 1 mm; Package / Case: 0402 (1005 metric); Product: General Type MLCCs; Series: GRM; Termination Style: SMD/SMT; Tolerance: 10 %; Width: 0.5 mm; Brand: Murata Electronics; Case Code - in: 0402; Case Code - mm: 1005; Dielectric: X7R; Maximum Operating Temperature: + 125 C; Minimum Operating Temperature: - 55 C; Standard Pack Qty: 10000; RoHS - Mouser: Y; Minimum Order Quantity: 1; Reeling: True
R32 R33 = 10 KOHM, 63 mW: Resistor; Manufacturer 1: VISHAY DALE; Supplier 1: Newark; Manufacturer Part Number: CRCW040210K0FKTD; RoHS: NO; Stock 1: 12163; Pricing 1: 1=0.073, 10=0.039, 100=0.023, 1000=0.019 (USD); ComponentLink1URL: http://www.farnell.com/datasheets/1914725.pdf; ComponentLink1Description: http://www.farnell.com/datasheets/1914725.pdf; Supplier Part Number 1: 96C9543
R34 R39 = 0R0: as R24 on sheet MCU; Supplier 1: Newark; Manufacturer: PANASONIC ELECTRONIC COMPONENTS; RoHS: YES; Stock 1: 130000; Pricing 1: 1=0.006, 10000=0.006 (USD); Resistance Tolerance: -; ComponentLink1URL: http://www.farnell.com/datasheets/2059623.pdf; ComponentLink1Description: http://www.farnell.com/datasheets/2059623.pdf; Supplier Part Number 1: 97W7189; Resistance: 0R0
R35 = 100K0,63mW: Resistor; Manufacturer: VISHAY; Supplier 1: Newark; Manufacturer Part Number: CRCW0402100KFKED; RoHS: YESX; Stock 1: 84915; Pricing 1: 1=0.131, 10=0.055, 25=0.05, 50=0.043, 100=0.038, 250=0.033, 500=0.026, 1000=0.021 (USD); ComponentLink1URL: http://www.farnell.com/cad/1551208.zip; ComponentLink1Description: http://www.farnell.com/cad/1551208.zip; ComponentLink2URL: http://www.farnell.com/datasheets/2310790.pdf; ComponentLink2Description: http://www.farnell.com/datasheets/2310790.pdf; Supplier Part Number 1: 61M5269
R37 R38 = 2K2: Resistor; Manufacturer: PANASONIC; Resistor Case Style: 0402 [1005 Metric]; Product Range: ERJ2; Voltage Rating: 50; Resistor Element Type: Thick Film; Power Rating: 100; Resistance Tolerance: ± 1%; Supplier 1: Newark; Manufacturer Part Number: ERJ-2RKF2201X; RoHS: YES; Stock 1: 10000; Pricing 1: 1=0.294, 25=0.044, 100=0.026, 250=0.024, 500=0.02, 1000=0.017, 2500=0.016, 5000=0.013 (USD); ComponentLink1URL: http://www.farnell.com/cad/1560012.zip; ComponentLink1Description: http://www.farnell.com/cad/1560012.zip; ComponentLink2URL: http://www.farnell.com/datasheets/1911175.pdf; ComponentLink2Description: http://www.farnell.com/datasheets/1911175.pdf; Supplier Part Number 1: 64R5268; Resistance: 2K2
U30 = GPS: Manufacturer: Maestro Wireless Solutions; Frequency: 1.575 GHz; Interface Type: UART, SPI; Number of Channels: 48 Channel; Acquisition Sensitivity: - 163 dBm; Horizontal Position Accuracy: 2.5 m; Operating Supply Current: 41 mA; Operating Supply Voltage: 3.3 V; Time To First Fix - Cold Start: 35 s; Supplier 1: Mouser; Manufacturer Part Number: A2200-A; RoHS: RoHS Compliant; Category: GPS Modules; Stock 1: 1186; Pricing 1: 1=21.31, 5=20.29, 10=19.37, 25=17.91, 50=17.42, 100=16.94, 250=15.50, 500=14.52, 1300=12.00 (MXN); Dimensions: 14 mm x 10.2 mm x 2.5 mm; Packaging: Cut Tape; Brand: Maestro Wireless Solutions; Mounting Style: SMD/SMT; Maximum Operating Temperature: + 85 C; Standard Pack Qty: 1300; Subcategory: Wireless & RF Modules; RoHS - Mouser: Y; Minimum Order Quantity: 1; Reeling: True; ComponentLink1URL: http://www.mouser.com/datasheet/2/251/Maestro_A2200_GPS_Module_Product_Brief_v14-2-1109224.pdf; ComponentLink1Description: http://www.mouser.com/datasheet/2/251/Maestro_A2200_GPS_Module_Product_Brief_v14-2-1109224.pdf; Supplier Part Number 1: 927-A2200-A
X30 = SMACONNECTOR_UFL: Connector UFL; Manufacturer: Taoglas; Supplier 1: Mouser; Manufacturer Part Number: RECE.20279.001E.01; RoHS: RoHS Compliant; Category: RF Connectors / Coaxial Connectors; Stock 1: 0; Brand: Taoglas; Product Type: RF Connectors / Coaxial Connectors; Subcategory: RF Interconnects; Minimum Order Quantity: 1; Reeling: False; Supplier Part Number 1: N/A

## Sheet bluetooth.SchDoc
size Letter
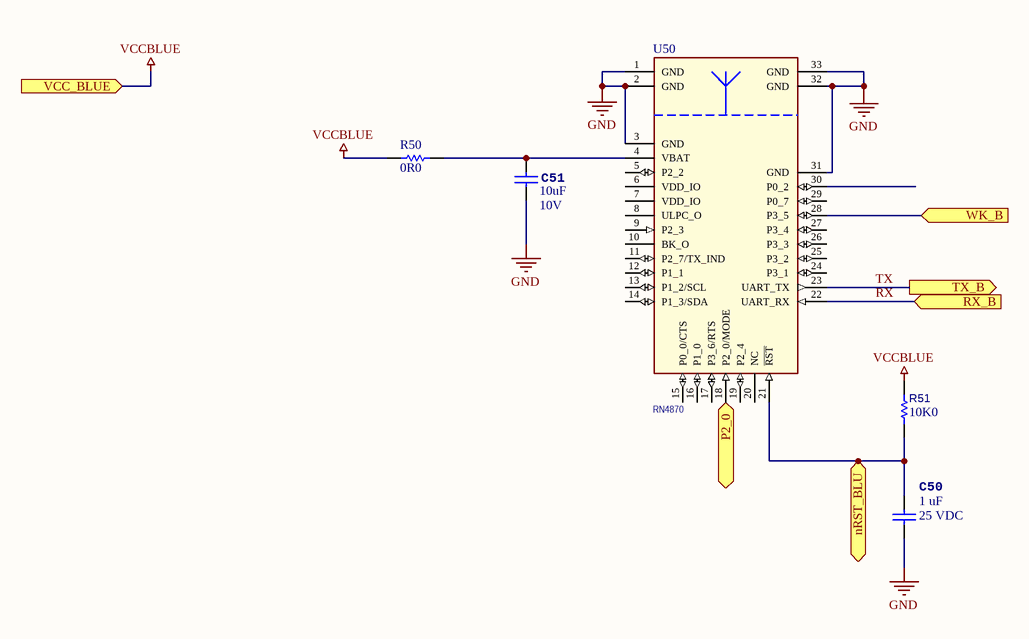
[diagram p4: bluetooth.SchDoc]

### Parts
C50  Capacitance: 1 uF  Voltage Rating DC: 25 VDC  [C0603]  (hidden comment: 1uF, 25V)
C51  Capacitance: 10uF  Voltage Rating DC: 10V  [C0402]  (hidden comment: ZRB15XR61A106ME01D)
R50  PANASONIC ELECTRONIC COMPONENTS  [0402_RES]  (value not drawn)
R51  Resistance: 10K0  [RESC0603]  (hidden comment: CRCW060310K0FKEB)
U50  value RN4870  [MOD_BM70BLES1FC2]  (hidden comment: 579-RN4870-I/RM140)

### Ports
nRST_BLU (in), P2_0 (in), RX_B (in), TX_B (out), VCC_BLUE (in), WK_B (in)

### Nets
GND: C50.2 C51.2 U50.1(GND) U50.2(GND) U50.3(GND) U50.31(GND) U50.32(GND) U50.33(GND)
VCCBLUE: R50.2 R51.1 ; port VCC_BLUE  [project net 3v3]
RX: U50.22(UART_RX) ; port RX_B
TX: U50.23(UART_TX) ; port TX_B
NetC50_1: C50.1 R51.2 U50.21(~{RST}) ; port nRST_BLU
NetC51_1: C51.1 R50.1 U50.4(VBAT)
NetU20_4: U50.28(P3_5) ; port WK_B
NetU20_5: U50.18(P2_0/MODE) ; port P2_0

Not connected (* = marked no-connect by the designer): U50 5(P2_2) 6(VDD_IO) 7(VDD_IO) 8(ULPC_O) 9(P2_3) 10(BK_O) 11(P2_7/TX_IND) 12(P1_1) 13(P1_2/SCL) 14(P1_3/SDA) 15(P0_0/CTS) 16(P1_0) 17(P3_6/RTS) 19(P2_4) 20(NC) 24(P3_1) 25(P3_2) 26(P3_3) 27(P3_4) 29(P0_7) 30(P0_2)

### Notes on the sheet
- Proyecto:
- CENTRO DE INGENIERIA Y DESARROLLO INDUSTRIAL
- Titulo:
- Fecha:
- Hoja:
- Elaborado por:
- de
- Hora:
- Revisión:
- Revisado por:
- CIDESI_template_letter

### Library data of the parts
C50 = 1uF, 25V: Cap_Cer; Manufacturer: Taiyo Yuden; Manufacturer Part Number: TMK107BLD105MA-T; Tolerance: 20 %; Capacitance - nF: 1000 nF; Dielectric: X5R; Product Status: New Product; Supplier 1: Mouser; RoHS: RoHS Compliant; Category: Multilayer Ceramic Capacitors MLCC - SMD/SMT; Stock 1: 6144; Pricing 1: 1=0.572, 10=0.280, 100=0.199, 500=0.179, 1000=0.152, 4000=0.152, 8000=0.118, 12000=0.108, 24000=0.104 (MXN); Height: 0.8 mm; Length: 1.6 mm; Package / Case: 0603 (1608 metric); Packaging: Cut Tape; Product: General Type MLCCs; Series: M; Termination Style: SMD/SMT; Width: 0.8 mm; Brand: Taiyo Yuden; Case Code - in: 0603; Case Code - mm: 1608; Maximum Operating Temperature: + 85 C; Minimum Operating Temperature: - 55 C; Product Type: Ceramic Capacitors; Standard Pack Qty: 4000; Subcategory: Capacitors; Termination: Standard; RoHS - Mouser: Y; Minimum Order Quantity: 1; Reeling: True; ComponentLink1URL: https://www.mouser.com/datasheet/2/396/mlcc02_e-1307760.pdf; ComponentLink1Description: https://www.mouser.com/datasheet/2/396/mlcc02_e-1307760.pdf; Supplier Part Number 1: 963-TMK107BLD105MA-T
C51 = 10uF, 10V: as C22 on sheet MCU; Supplier 1: Mouser; Manufacturer Part Number: ZRB15XR61A106ME01D; RoHS: RoHS Compliant; Category: Multilayer Ceramic Capacitors MLCC - SMD/SMT; Stock 1: 361820; Pricing 1: 1=0.624, 10=0.436, 100=0.261, 500=0.196, 1000=0.165, 2500=0.137, 5000=0.129, 8000=0.117, 24000=0.113 (MXN); Height: 0.65 mm; Length: 1 mm; Package / Case: 0402 (1005 metric); Packaging: Cut Tape; Product: General Type MLCCs; Series: ZRB; Termination Style: SMD/SMT; Width: 0.5 mm; Brand: Murata Electronics; Case Code - in: 0402; Case Code - mm: 1005; Maximum Operating Temperature: + 85 C; Minimum Operating Temperature: - 55 C; Product Type: Ceramic Capacitors; Standard Pack Qty: 8000; Subcategory: Capacitors; Termination: Interposer Substrate; RoHS - Mouser: Y; Minimum Order Quantity: 1; Reeling: True; ComponentLink1URL: https://www.mouser.com/datasheet/2/281/ZRB15XR61A106ME01-01-1771691.pdf; ComponentLink1Description: https://www.mouser.com/datasheet/2/281/ZRB15XR61A106ME01-01-1771691.pdf; Supplier Part Number 1: 81-ZRB15XR61A106ME1D
R50 = 0R0: as R24 on sheet MCU; Supplier 1: Newark; Manufacturer: PANASONIC ELECTRONIC COMPONENTS; RoHS: YES; Stock 1: 130000; Pricing 1: 1=0.006, 10000=0.006 (USD); Resistance Tolerance: -; ComponentLink1URL: http://www.farnell.com/datasheets/2059623.pdf; ComponentLink1Description: http://www.farnell.com/datasheets/2059623.pdf; Supplier Part Number 1: 97W7189; Resistance: 0R0
R51 = 10K0,100mW: Resistor; Manufacturer: Vishay / Dale; Power Rating: 100 mW (1/10 W); Temperature Coefficient: 100 PPM / C; Tolerance: 1 %; Voltage Rating: 75 V; Qualification: AEC-Q200; Supplier 1: Mouser; Manufacturer Part Number: CRCW060310K0FKEB; RoHS: RoHS Compliant By Exemption; Category: Thick Film Resistors - SMD; Stock 1: 86899; Pricing 1: 1=0.130, 10=0.048, 100=0.020, 1000=0.013, 10000=0.008, 30000=0.005 (MXN); Application: Automotive Grade; Features: -; Height: 0.45 mm; Length: 1.55 mm; Package / Case: -; Packaging: Cut Tape; Product: Thick Film Resistors SMD; Series: D/CRCW e3; Technology: Thick Film; Termination Style: SMD/SMT; Type: Chip Resistor; Width: 0.85 mm; Brand: Vishay / Dale; Mounting Style: PCB Mount; Case Code - in: 0603; Case Code - mm: 1608; Maximum Operating Temperature: + 155 C; Minimum Operating Temperature: - 55 C; Product Type: Thick Film Resistors; Standard Pack Qty: 10000; Subcategory: Resistors; RoHS - Mouser: E; Minimum Order Quantity: 1; Reeling: True; ComponentLink1URL: https://www.mouser.com/datasheet/2/427/dcrcwe3-1762152.pdf; ComponentLink1Description: https://www.mouser.com/datasheet/2/427/dcrcwe3-1762152.pdf; Supplier Part Number 1: 71-CRCW060310K0FKEB
U50 = 579-RN4870-I/RM140: BLUETOOTH; Manufacturer: Microchip Technology; Antenna: Ceramic Chip; Data Rate: 10 kb/s; Frequency: 2.4 GHz; Frequency Range: 2.402 GHz to 2.48 GHz; Output Power: 0 dBm; Range: 50 m; Sensitivity: - 90 dBm; Shielding: Shielded; Interface Type: UART; Class: Bluetooth Low Energy (BLE); Modulation Technique: GFSK; Operating Supply Voltage: 3.3 V; Protocol: Bluetooth 5.0; Protocol - Bluetooth, BLE - 802.15.1: BLE; Product Status: New Product; Supplier 1: Mouser; Manufacturer Part Number: RN4870-I/RM140; RoHS: RoHS Compliant; Category: Bluetooth Modules (802.15.1); Stock 1: 157; Pricing 1: 1=9.14, 25=8.35 (MXN); Packaging: Tray; Product: Bluetooth Modules; Series: RN4870; Type: USB Adapter; Brand: Microchip Technology; Mounting Style: SMD/SMT; Maximum Operating Temperature: + 85 C; Minimum Operating Temperature: - 40 C; Product Type: Bluetooth Modules; Standard Pack Qty: 88; Subcategory: Wireless & RF Modules; RoHS - Mouser: Y; Minimum Order Quantity: 1; Reeling: False; ComponentLink1URL: https://www.mouser.com/datasheet/2/268/RN4870-71-Bluetooth-Low-Energy-Module-Data-Sheet-D-1658564.pdf; ComponentLink1Description: https://www.mouser.com/datasheet/2/268/RN4870-71-Bluetooth-Low-Energy-Module-Data-Sheet-D-1658564.pdf; Supplier Part Number 1: 579-RN4870-I/RM140

## Nets that join several sheets
3v3: Supply (5 pins), MCU (6 pins), GPS (R33.2 R34.2 R39.1), bluetooth (R50.2 R51.1)
GND: Supply (22 pins), MCU (22 pins), GPS (7 pins), bluetooth (8 pins)
NetC30_1: MCU (U20.8), GPS (C30.1 R33.1 U30.22)
NetC50_1: MCU (U20.9), bluetooth (C50.1 R51.2 U50.21)
NetR26_2: MCU (R26.2), GPS (U30.4)
NetR27_2: MCU (R27.2), GPS (U30.3)
NetU20_4: MCU (U20.4), bluetooth (U50.28)
NetU20_5: MCU (U20.5), bluetooth (U50.18)
NetU20_6: MCU (U20.6), GPS (U30.6)
NetU20_7: MCU (U20.7), GPS (U30.19)
RX: MCU (R25.2), bluetooth (U50.22)
TX: MCU (R24.2), bluetooth (U50.23)